# Altium schematic sheet Power Supply.SchDoc
size A3; SheetNumber: 3; SheetTotal: 4
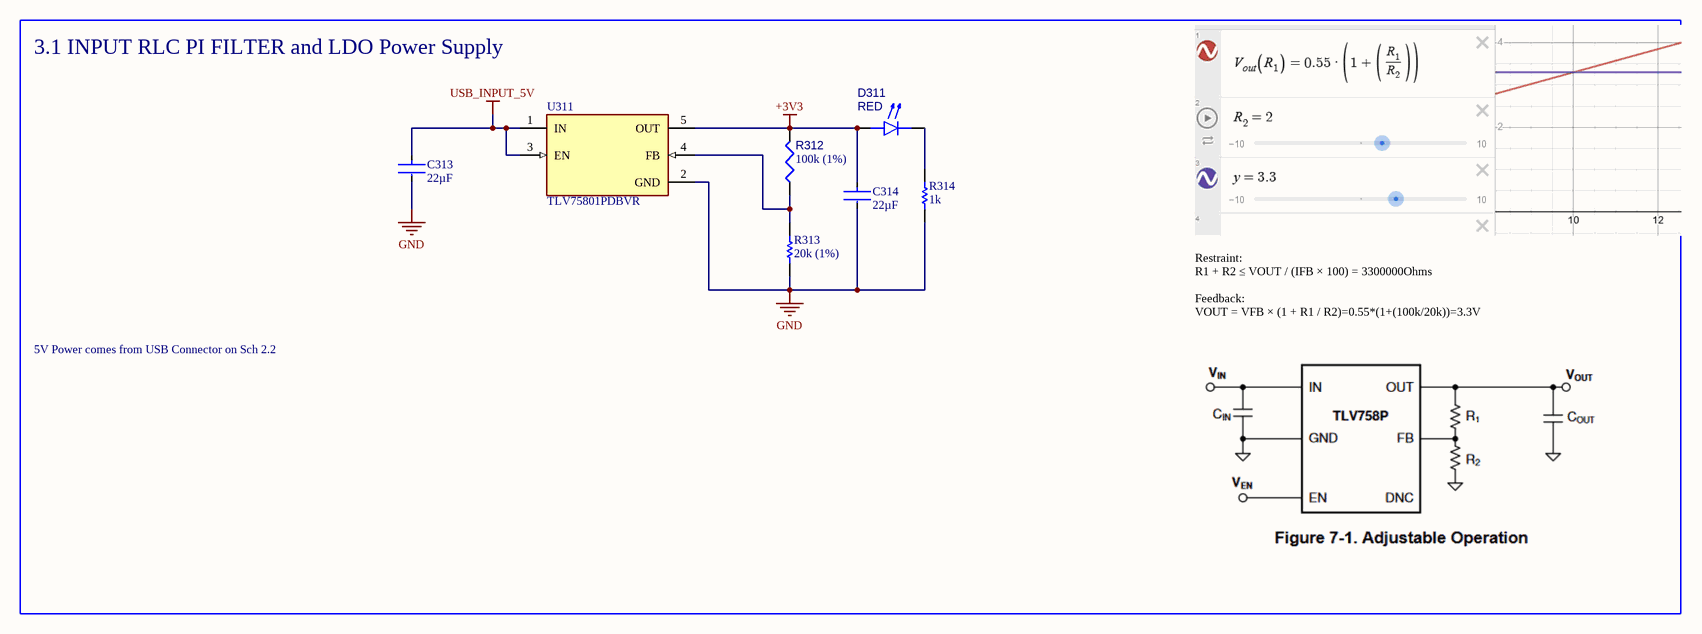
[diagram p0: Power Supply.SchDoc]

## Parts
C313  value 22µF  [FP-GRM21B-0_2-e0_2_0_7-MFG]  (hidden comment: GRM21BZ71A226ME15L)
C314  value 22µF  [FP-GRM21B-0_2-e0_2_0_7-MFG]  (hidden comment: GRM21BZ71A226ME15L)
D311  RED  [WL-SMCW_0603_150060xx75000]
R312  value 100k (1%)  [RESC1608X55X25ML10T15]  (hidden comment: Resistor 100k +/-1% 0603 100 mW)
R313  value 20k (1%)  [RESC1608X55X25ML10T15]  (hidden comment: RC0603FR-1320KL)
R314  value 1k  [RESC2013X60X35ML10T20]  (hidden comment: RC0805FR-071KL)
U311  TLV75801PDBVR  [FP-DBV0005A-IPC_B]

## Nets
+3V3: C314.1 D311.2(A) R312.2 U311.5(OUT)
GND: C313.2 C314.2 R313.2 R314.1 U311.2(GND)
USB_INPUT_5V: C313.1 U311.1(IN) U311.3(EN)
NetD311_1: D311.1(K) R314.2
NetR312_1: R312.1 R313.1 U311.4(FB)

## Notes on the sheet
- 3.1 INPUT RLC PI FILTER and LDO Power Supply
- Restraint:
  R1 + R2 ≤ VOUT / (IFB × 100) = 3300000Ohms
- 5V Power comes from USB Connector on Sch 2.2
- Feedback:
  VOUT = VFB × (1 + R1 / R2)=0.55*(1+(100k/20k))=3.3V

## Library data of the parts
C313 C314 = CMP-001-00090-1: Ceramic Capacitor, Multilayer, Ceramic, 10V, 20% +Tol, 20% -Tol, X7R, 15% TC, 22uF, Surface Mount, 0805; Min Operating Temperature: -55°C; Mounting Technology: Surface Mount; Case/Package: 0805; Max Operating Temperature: 125°C; Pins: 2; RoHS Compliant: Yes; Capacitor Type: Ceramic
D311 = CMP-007-00037-1: Single Color LED, Red, Water Clear, 1.1mm; RoHS Compliant: Yes; Max Operating Temperature: 85°C; Min Operating Temperature: -40°C
R312 = CMP-009-00023-5: Chip Resistor, 100 KOhm, +/- 1%, 0.1 W, -55 to 155 degC, 0603 (1608 Metric); Voltage Rating: 50V; Power: 100mW; Max Operating Temperature: 155°C; RoHS Compliant: True; Tolerance: 1%; Pins: 2; Case/Package: 0603; Mounting Technology: SM; Min Operating Temperature: -55°C
R313 = CMP-009-00200-1: Fixed Resistor, Metal Glaze/thick Film, 0.1W, 20000ohm, 75V, 1% +/-Tol, 100ppm/Cel, Surface Mount, 0603; Power: 100mW; Package Width: 0.8mm; Package Length: 1.6mm; Package Height: 0.45mm; Rated Temperature: 70°C; Additional Feature: LASER TRIMMABLE; Temperature Coefficient: 100ppm/°C; Working Voltage: 75V; Technology: METAL GLAZE/THICK FILM; RoHS Compliant: Yes; Package Style: SMTMeter; Max Operating Temperature: 155°C; Termination: Wraparound; JESD-609 Code: e3; Case/Package: 0603; Mounting Technology: Surface Mount; Pins: 2; Tolerance: 1%; Terminal Finish: Nickel; Package Shape: Rectangular; Min Operating Temperature: -55°C; Reach SVHC Compliant: Yes; Construction: Chip; Packaging: Tape and Reel; Resistor Type: FIXED RESISTOR
R314 = CMP-009-00207-1: Fixed Resistor, Metal Glaze/thick Film, 0.125W, 1000ohm, 150V, 1% +/-Tol, 100ppm/Cel, Surface Mount, 0805; Temperature Coefficient: 100ppm/°C; Package Height: 0.5mm; Power: 125mW; Rated Temperature: 70°C; Package Width: 1.25mm; Package Length: 2mm; Additional Feature: LASER TRIMMABLE; Technology: METAL GLAZE/THICK FILM; RoHS Compliant: Yes; Construction: Chip; Case/Package: 0805; Resistor Type: FIXED RESISTOR; JESD-609 Code: e3; Packaging: Tape and Reel; Tolerance: 1%; Reach SVHC Compliant: Yes; Max Operating Temperature: 155°C; Terminal Finish: Nickel; Min Operating Temperature: -55°C; Package Style: SMTMeter; Mounting Technology: Surface Mount; Working Voltage: 150V; Pins: 2; Package Shape: Rectangular; Termination: Wraparound
U311 = CMP-019-00054-1: Adjustable Positive LDO Regulator, 0.55V Min, 5.5V Max, PDSO5